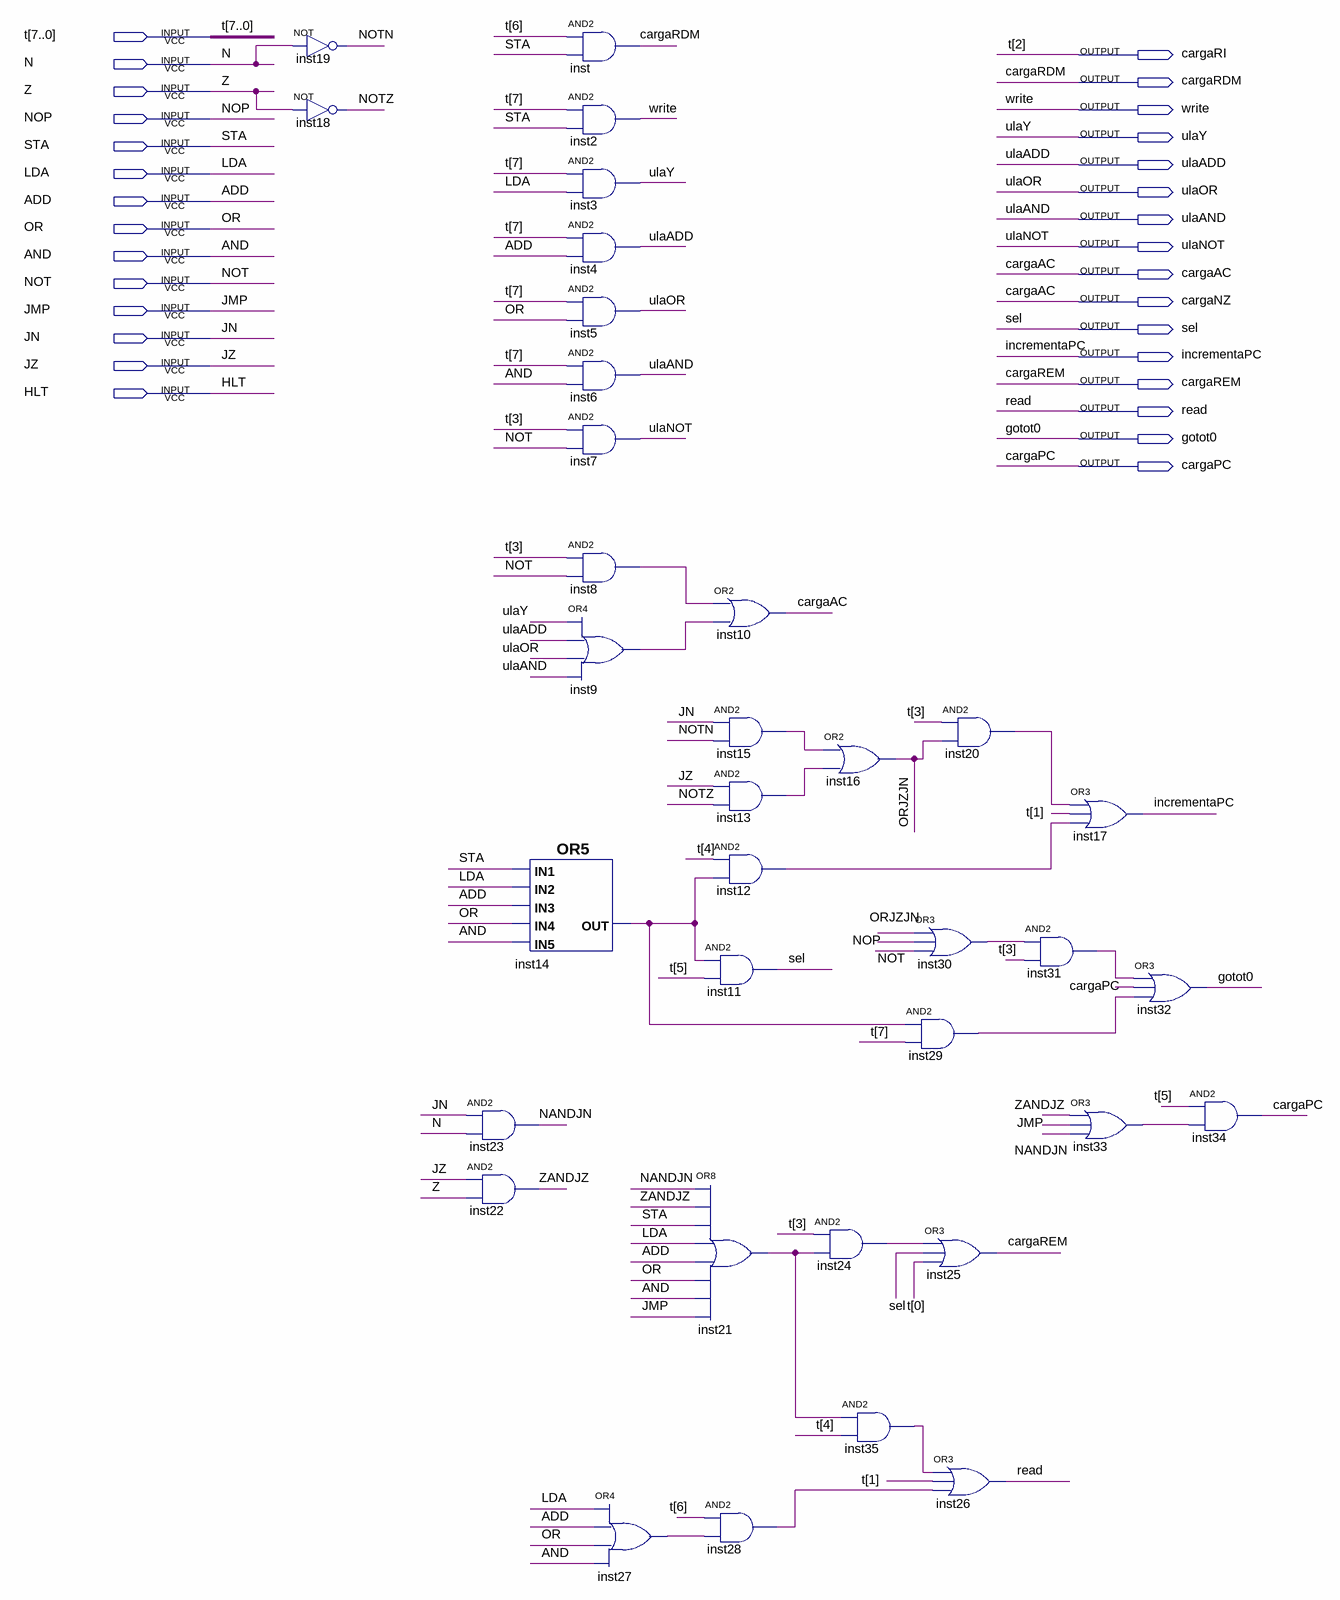
[diagram p0: schematic sheet]
// Quartus schematic controller.bdf as structural Verilog: 35 symbols, 30 pins
module controller (
  input  [7:0] t,
  input  N,
  input  Z,
  input  NOP,
  input  STA,
  input  LDA,
  input  ADD,
  input  OR,
  input  AND,
  input  NOT,
  input  JMP,
  input  JN,
  input  JZ,
  input  HLT,
  output cargaRI,
  output cargaRDM,
  output write,
  output ulaY,
  output ulaADD,
  output ulaOR,
  output ulaAND,
  output ulaNOT,
  output cargaAC,
  output cargaNZ,
  output sel,
  output incrementaPC,
  output cargaREM,
  output read,
  output gotot0,
  output cargaPC
);

  wire inst8_out, inst9_out, inst12_out, inst13_out, inst14_out, inst15_out, inst20_out, inst21_out,
       inst24_out, inst27_out, inst28_out, inst29_out, inst30_out, inst31_out, inst33_out, inst35_out,
       NANDJN, NOTN, NOTZ, ORJZJN, ZANDJZ;

  not inst19 (NOTN, N);
  not inst18 (NOTZ, Z);
  or inst14 (inst14_out, STA, LDA, ADD, OR, AND);
  and inst23 (NANDJN, JN, N);
  and inst22 (ZANDJZ, JZ, Z);
  and inst (cargaRDM, t[6], STA);
  and inst2 (write, t[7], STA);
  and inst3 (ulaY, t[7], LDA);
  and inst4 (ulaADD, t[7], ADD);
  and inst5 (ulaOR, t[7], OR);
  and inst6 (ulaAND, t[7], AND);
  and inst7 (ulaNOT, t[3], NOT);
  and inst8 (inst8_out, t[3], NOT);
  or inst9 (inst9_out, ulaY, ulaADD, ulaOR, ulaAND);
  or inst27 (inst27_out, LDA, ADD, OR, AND);
  or inst10 (cargaAC, inst8_out, inst9_out);
  and inst15 (inst15_out, JN, NOTN);
  and inst13 (inst13_out, JZ, NOTZ);
  and inst12 (inst12_out, t[4], inst14_out);
  and inst11 (sel, inst14_out, t[5]);
  or inst21 (inst21_out, NANDJN, ZANDJZ, STA, LDA, ADD, OR, AND, JMP);
  and inst28 (inst28_out, t[6], inst27_out);
  or inst16 (ORJZJN, inst15_out, inst13_out);
  and inst24 (inst24_out, t[3], inst21_out);
  and inst35 (inst35_out, inst21_out, t[4]);
  and inst20 (inst20_out, t[3], ORJZJN);
  or inst30 (inst30_out, ORJZJN, NOP, NOT);
  and inst29 (inst29_out, inst14_out, t[7]);
  or inst25 (cargaREM, inst24_out, sel, t[0]);
  or inst26 (read, inst35_out, t[1], inst28_out);
  and inst31 (inst31_out, inst30_out, t[3]);
  or inst17 (incrementaPC, inst20_out, t[1], inst12_out);
  or inst33 (inst33_out, ZANDJZ, JMP, NANDJN);
  or inst32 (gotot0, inst31_out, cargaPC, inst29_out);
  and inst34 (cargaPC, t[5], inst33_out);

  assign cargaNZ = cargaAC;
  assign cargaRI = t[2];
endmodule
